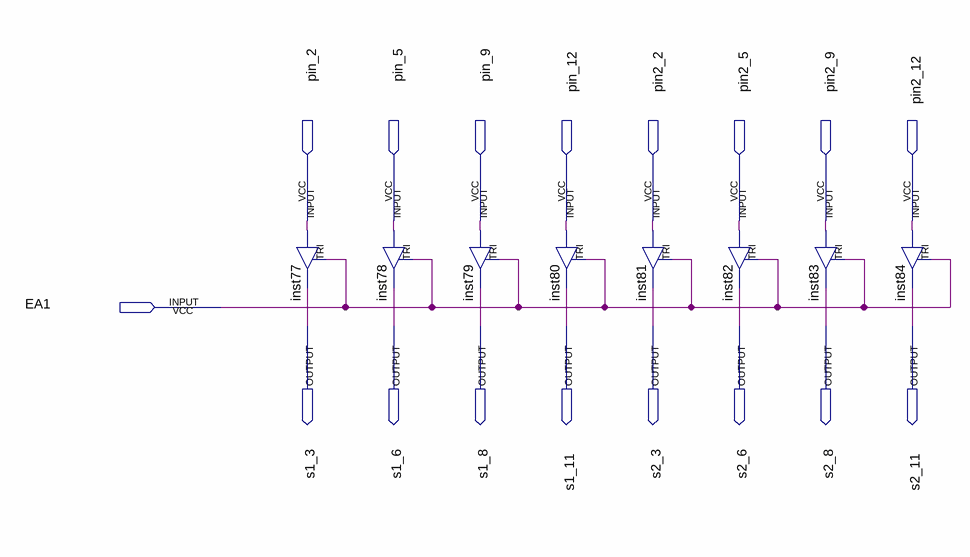
[diagram p0: schematic sheet]
// Quartus schematic 74LS126.bdf as structural Verilog: 8 symbols, 17 pins
module \74LS126  (
  input  pin_2,
  input  pin_5,
  input  pin_9,
  input  pin_12,
  input  pin2_2,
  input  pin2_5,
  input  pin2_9,
  input  pin2_12,
  input  EA1,
  output s1_3,
  output s1_6,
  output s1_8,
  output s1_11,
  output s2_3,
  output s2_6,
  output s2_8,
  output s2_11
);

  TRI inst77 (.IN(pin_2), .OE(EA1), .OUT(s1_3));
  TRI inst78 (.IN(pin_5), .OE(EA1), .OUT(s1_6));
  TRI inst79 (.IN(pin_9), .OE(EA1), .OUT(s1_8));
  TRI inst80 (.IN(pin_12), .OE(EA1), .OUT(s1_11));
  TRI inst81 (.IN(pin2_2), .OE(EA1), .OUT(s2_3));
  TRI inst82 (.IN(pin2_5), .OE(EA1), .OUT(s2_6));
  TRI inst83 (.IN(pin2_9), .OE(EA1), .OUT(s2_8));
  TRI inst84 (.IN(pin2_12), .OE(EA1), .OUT(s2_11));
endmodule
